# Altium schematic sheet DS136-1.0氧化还原传感器.SchDoc
size A4; SheetNumber: 1; SheetTotal: 1
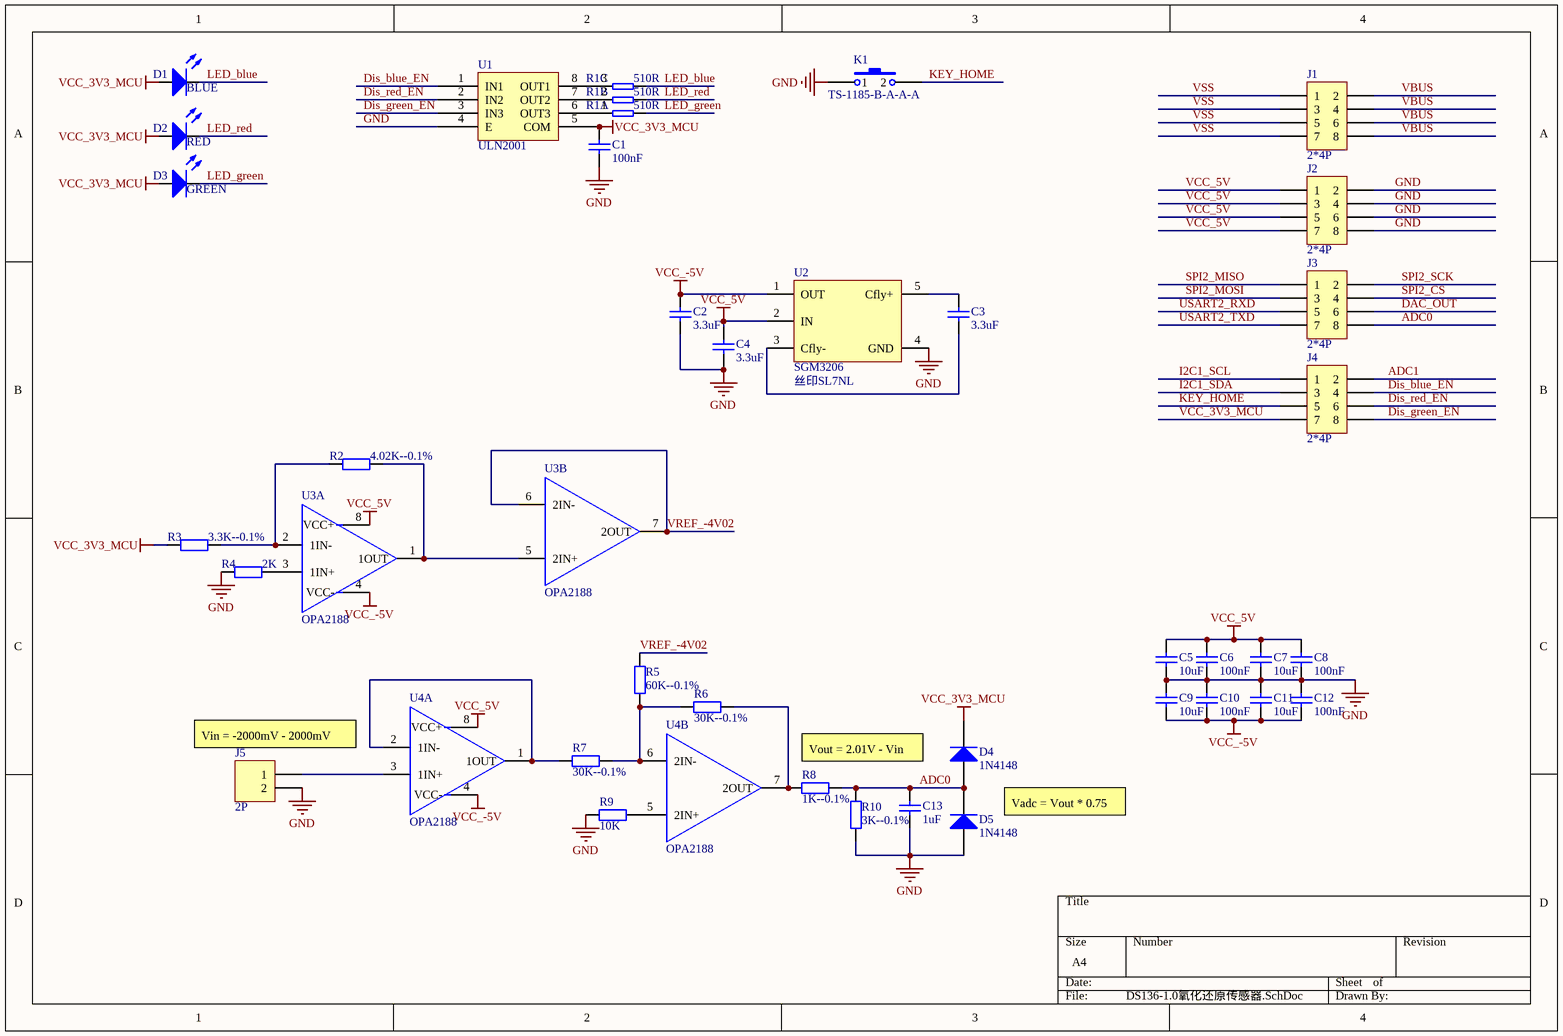
[diagram p0: DS136-1.0氧化还原传感器.SchDoc]

## Parts
C1  value 100nF  [0603CAP]  (hidden comment: SMDCAP00013)
C2  value 3.3uF  [0603CAP]  (hidden comment: SMDCAP00013)
C3  value 3.3uF  [0603CAP]  (hidden comment: SMDCAP00013)
C4  value 3.3uF  [0603CAP]  (hidden comment: SMDCAP00013)
C5  value 10uF  [0603CAP]  (hidden comment: SMDCAP00016)
C6  value 100nF  [0603CAP]  (hidden comment: SMDCAP00013)
C7  value 10uF  [0603CAP]  (hidden comment: SMDCAP00016)
C8  value 100nF  [0603CAP]  (hidden comment: SMDCAP00013)
C9  value 10uF  [0603CAP]  (hidden comment: SMDCAP00016)
C10  value 100nF  [0603CAP]  (hidden comment: SMDCAP00013)
C11  value 10uF  [0603CAP]  (hidden comment: SMDCAP00016)
C12  value 100nF  [0603CAP]  (hidden comment: SMDCAP00013)
C13  value 1uF  [0603CAP]  (hidden comment: SMDCAP00015)
D1  value BLUE  [LED_0805]  (hidden comment: SMDLED00010)
D2  value RED  [LED_0805]  (hidden comment: SMDLED00003)
D3  value GREEN  [LED_0805]  (hidden comment: Chip 翠绿LED 0805)
D4  value 1N4148  [LL-34]  (hidden comment: SMDDIODE02001)
D5  value 1N4148  [LL-34]  (hidden comment: SMDDIODE02001)
J1  value 2*4P  [X1321WVS-2x04J-C40D53]  (hidden comment: X1321WVS-2x04J-C40D53)
J2  value 2*4P  [X1321WVS-2x04J-C40D53]  (hidden comment: X1321WVS-2x04J-C40D53)
J3  value 2*4P  [X1321WVS-2x04J-C40D53]  (hidden comment: X1321WVS-2x04J-C40D53)
J4  value 2*4P  [X1321WVS-2x04J-C40D53]  (hidden comment: X1321WVS-2x04J-C40D53)
J5  value 2P  [SIP2]  (hidden comment: SL000000042)
K1  TS-1185-B-A-A-A  [KEY_TS-1185-x-A-A-A]
R1  value 510R  [0603RES_Pack4]  (hidden comment: SMDRES05003)  (parts A,B,C of 4)
R2  value 4.02K--0.1%  [0603RES]  (hidden comment: SMDRES00060)
R3  value 3.3K--0.1%  [0603RES]  (hidden comment: SMDRES00090)
R4  value 2K  [0603RES]  (hidden comment: SMDRES00042)
R5  value 60K--0.1%  [0603RES]  (hidden comment: SMDRES00060)
R6  value 30K--0.1%  [0603RES]  (hidden comment: SMDRES00060)
R7  value 30K--0.1%  [0603RES]  (hidden comment: SMDRES00060)
R8  value 1K--0.1%  [0603RES]  (hidden comment: SMDRES00034)
R9  value 10K  [0603RES]  (hidden comment: SMDRES00056)
R10  value 3K--0.1%  [0603RES]  (hidden comment: Chip 3K 1/16W ±1％ 0603)
U1  value ULN2001  [SO-8]  (hidden comment: SMDIC000018)
U2  SGM3206  value 丝印SL7NL  [SOT23-5]
U3  OPA2188  [SO-8]  (parts A,B of 2)
U4  OPA2188  [SO-8]  (parts A,B of 2)

## Nets
GND: C1.1 C2.1 C4.2 C5.1 C6.1 C7.1 C8.1 C9.2 C10.2 C11.2 C12.2 C13.1 D5.1(A) J2.2 J2.4 J2.6 J2.8 J5.2 K1.1 R4.1 R9.1 R10.1 U1.4(E) U2.4(GND)
VCC_3V3_MCU: C1.2 D1.1(A) D2.1(A) D3.1(A) D4.2(K) J4.7 R3.2 U1.5(COM)
VCC_5V: C4.1 C5.2 C6.2 C7.2 C8.2 J2.1 J2.3 J2.5 J2.7 U2.2(IN) U3.8(VCC+) U4.8(VCC+)
VCC_-5V: C2.2 C9.1 C10.1 C11.1 C12.1 U2.1(OUT) U3.4(VCC-) U4.4(VCC-)
ADC0: C13.2 D4.1(A) D5.2(K) J3.8 R8.2 R10.2
ADC1: J4.2
DAC_OUT: J3.6
Dis_blue_EN: J4.4 U1.1(IN1)
Dis_green_EN: J4.8 U1.3(IN3)
Dis_red_EN: J4.6 U1.2(IN2)
I2C1_SCL: J4.1
I2C1_SDA: J4.3
KEY_HOME: J4.5 K1.2
LED_blue: D1.2(K) R1.6
LED_green: D3.2(K) R1.8
LED_red: D2.2(K) R1.7
SPI2_CS: J3.4
SPI2_MISO: J3.1
SPI2_MOSI: J3.3
SPI2_SCK: J3.2
USART2_RXD: J3.5
USART2_TXD: J3.7
VBUS: J1.2 J1.4 J1.6 J1.8
VREF_-4V02: R5.2 U3.6(2IN-) U3.7(2OUT)
VSS: J1.1 J1.3 J1.5 J1.7
NetC3_1: C3.1 U2.5(Cfly+)
NetC3_2: C3.2 U2.3(Cfly-)
NetJ5_1: J5.1 U4.3(1IN+)
NetR1_1: R1.1 U1.6(OUT3)
NetR1_2: R1.2 U1.7(OUT2)
NetR1_3: R1.3 U1.8(OUT1)
NetR2_1: R2.1 U3.1(1OUT) U3.5(2IN+)
NetR2_2: R2.2 R3.1 U3.2(1IN-)
NetR4_2: R4.2 U3.3(1IN+)
NetR5_1: R5.1 R6.1 R7.2 U4.6(2IN-)
NetR6_2: R6.2 R8.1 U4.7(2OUT)
NetR7_1: R7.1 U4.1(1OUT) U4.2(1IN-)
NetR9_2: R9.2 U4.5(2IN+)

## Notes on the sheet
- (near J5) Vin = -2000mV - 2000mV
- Vout = 2.01V - Vin
- Vadc = Vout * 0.75

## Library data of the parts
C1-C4 C6 C8 C10 C12 = MLCC 100nF 50V ±10％ 0603: 贴片电容
C5 C7 C9 C11 = MLCC 10uF 50V ±10％ 0603: 贴片电容
C13 = MLCC 1uF 50V ±10％ 0603: 贴片电容
D1 = Chip 蓝色LED 0805: 贴片LED
D2 = Chip 红色LED 0805: 贴片LED
D3 = Chip 翠绿LED 0805: 贴片LED
D4 D5 = 玻封 1/2W 1N4148 LL-34: 贴片二极管
J1-J4 = X1321WVS-2x04J-C40D53: 双排针2x4P 立贴 1.27mm
J5 = DIP2 单排直针 1*40P 间距2.54mm 针长11mm 铜: 单排直针
K1 = TS-1185-B-A-A-A: 轻触开关; Value: TS-1185-B-A-A-A
R1 = Chip R*4 510R 1/16W ±5％ 0603: 贴片排阻
R2 R5-R7 = Chip 30K 1/16W ±1％ 0603: 贴片电阻
R3 = Chip 3.3K 1/16W ±1％ 0603: 贴片电阻
R4 = Chip 2K 1/16W ±1％ 0603: 贴片电阻
R8 = Chip 1K 1/16W ±1％ 0603: 贴片电阻
R9 = Chip 10K 1/16W ±1％ 0603: 贴片电阻
R10 = Chip 3K 1/16W ±1％ 0603: 贴片电阻
U1 = ULN2001 SOP-8: 电机驱动芯片
U2 = SGM3206: 电荷泵芯片
U3 U4 = TL062C